# EAGLE design gps_tracker_A2235h (EAGLE 7.4.0)
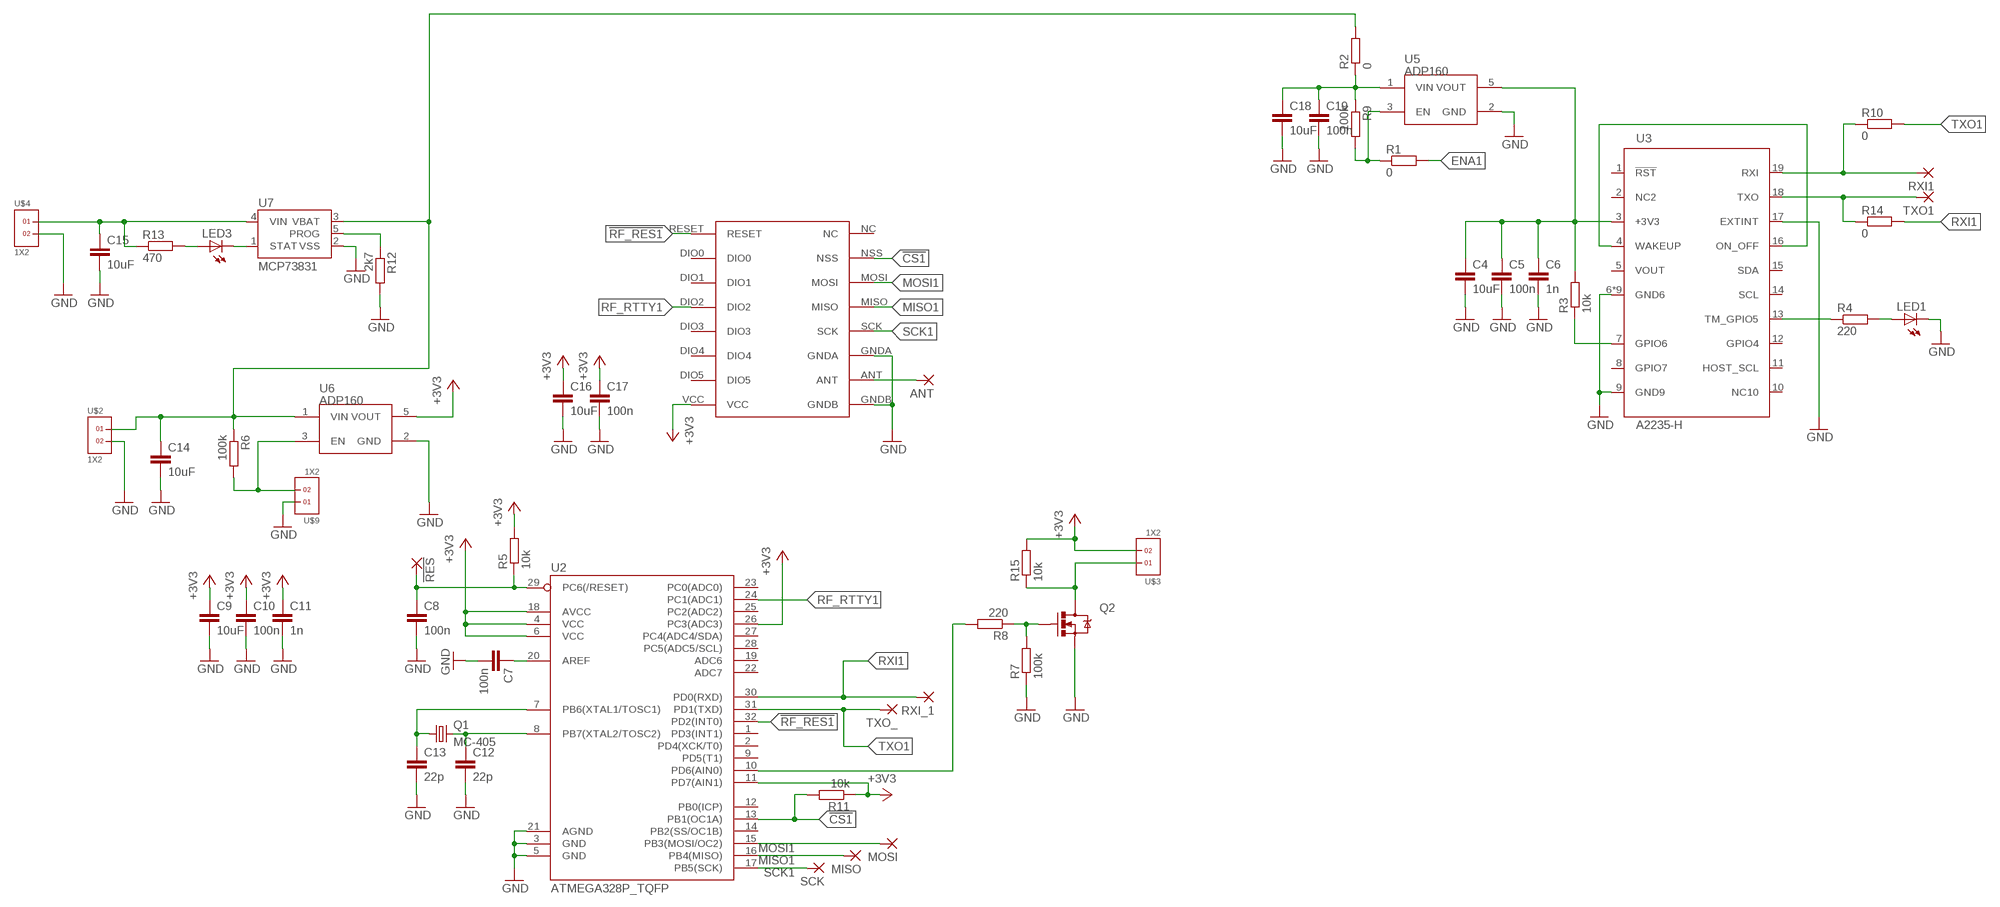
[diagram p0: schematic, sheet 1]

## Parts
!RES  SMD2  [SMD1,27-2,54]
ANT  SMD2  [SMD1,27-2,54]
C4  10uF  C-EUC0603  [C0603]
C5  100n  C-EUC0603  [C0603]
C6  1n  C-EUC0603  [C0603]
C7  100n  C-EUC0603  [C0603]
C8  100n  C-EUC0603  [C0603]
C9  10uF  C-EUC0603  [C0603]
C10  100n  C-EUC0603  [C0603]
C11  1n  C-EUC0603  [C0603]
C12  22p  C-EUC0603  [C0603]
C13  22p  C-EUC0603  [C0603]
C14  10uF  C-EUC0603  [C0603]
C15  10uF  C-EUC0603  [C0603]
C16  10uF  C-EUC0603  [C0603]
C17  100n  C-EUC0603  [C0603]
C18  10uF  C-EUC0603  [C0603]
C19  100n  C-EUC0603  [C0603]
LED1  LEDCHIPLED_0603  [CHIPLED_0603]
LED3  LEDCHIPLED_0603  [CHIPLED_0603]
MISO  SMD2  [SMD1,27-2,54]
MOSI  SMD2  [SMD1,27-2,54]
Q1  MC-405  [MC-405]
Q2  MOSFET-NCHANNELAO3404A  [SOT23-3]
R1  0  R-EU_R0603  [R0603]
R2  0  R-EU_R0603  [R0603]
R3  10k  R-EU_R0603  [R0603]
R4  220  R-EU_R0603  [R0603]
R5  10k  R-EU_R0603  [R0603]
R6  100k  R-EU_R0603  [R0603]
R7  100k  R-EU_R0603  [R0603]
R8  220  R-EU_R0603  [R0603]
R9  100k  R-EU_R0603  [R0603]
R10  0  R-EU_R0603  [R0603]
R11  10k  R-EU_R0603  [R0603]
R12  2k7  R-EU_R0603  [R0603]
R13  470  R-EU_R0603  [R0603]
R14  0  R-EU_R0603  [R0603]
R15  10k  R-EU_R0603  [R0603]
RXI1  SMD2  [SMD1,27-2,54]
RXI_1  SMD2  [SMD1,27-2,54]
SCK  SMD2  [SMD1,27-2,54]
TXO1  SMD2  [SMD1,27-2,54]
TXO_  SMD2  [SMD1,27-2,54]
U2  ATMEGA328P_TQFP  [TQFP32-08]
U3  A2235-H  [A2235-H]
U5  ADP160  [SOT23-5]
U6  ADP160  [SOT23-5]
U7  MCP73831  [SOT23-5]
U$2  1X2  [1X2]
U$3  1X2  [1X2]
U$4  1X2  [1X2]
U$5  RFM69HW  [RFM]
U$9  1X2  [1X2]

## Nets
!CS1: R11.2 U2.13(PB1(OC1A)) U$5.NSS
!RF_RES1: U2.32(PD2(INT0)) U$5.RESET
+3V3_1: C9.1 C10.1 C11.1 C16.1 C17.1 R5.2 R11.1 R15.2 U2.4(VCC) U2.6(VCC) U2.11(PD7(AIN1)) U2.18(AVCC) U2.26(PC3(ADC3)) U6.5(VOUT) U$3.2 U$5.VCC ; supply symbol labelled +3V3
+BAT1: C14.1 R2.2 R6.1 U6.1(VIN) U7.3(VBAT) U$2.1
ENA1: R1.2 R6.2 U6.3(EN) U$9.2
GND1: C4.2 C5.2 C6.2 C7.2 C8.2 C9.2 C10.2 C11.2 C12.2 C13.2 C14.2 C15.2 C16.2 C17.2 C18.2 C19.2 LED1.C Q2.2(S) R7.1 R12.2 U2.3(GND) U2.5(GND) U2.21(AGND) U3.6(GND6) U3.9(GND9) U3.17(EXTINT) U3.101(GND6) U3.102(GND6) U3.103(GND6) U3.104(GND6) U3.105(GND6) U3.106(GND6) U3.107(GND6) U3.108(GND6) U5.2(GND) U6.2(GND) U7.2(VSS) U$2.2 U$4.2 U$5.GNDA U$5.GNDB U$9.1 ; supply symbol labelled GND
MISO1: MISO.1(P) U2.16(PB4(MISO)) U$5.MISO
MOSI1: MOSI.1(P) U2.15(PB3(MOSI/OC2)) U$5.MOSI
N$2: R1.1 R9.2 U5.3(EN)
N$3: C18.1 C19.1 R2.1 R9.1 U5.1(VIN)
N$6: R3.1 U3.7(GPIO6)
N$7: LED1.A R4.2
N$8: R4.1 U3.13(TM_GPIO5)
N$9: U3.4(WAKEUP) U3.16(ON_OFF)
N$11: R12.1 U7.5(PROG)
N$12: C7.1 U2.20(AREF)
N$13: !RES.1(P) C8.1 R5.1 U2.29(PC6(/RESET))
N$14: ANT.1(P) U$5.ANT
N$15: C12.1 Q1.2 U2.8(PB7(XTAL2/TOSC2))
N$16: C13.1 Q1.1 U2.7(PB6(XTAL1/TOSC1))
N$18: LED3.C U7.1(STAT)
N$19: Q2.1(G) R7.2 R8.1
N$20: R8.2 U2.10(PD6(AIN0))
N$21: Q2.3(D) R15.1 U$3.1
N$22: LED3.A R13.2
N$24: C15.1 R13.1 U7.4(VIN) U$4.1
N$27: C4.1 C5.1 C6.1 R3.2 U3.3(+3V3) U5.5(VOUT)
RF_RTTY1: U2.24(PC1(ADC1)) U$5.DIO2
RXI1: R14.2 RXI_1.1(P) U2.30(PD0(RXD))
RXI_G1: R10.1 RXI1.1(P) U3.19(RXI)
SCK1: SCK.1(P) U2.17(PB5(SCK)) U$5.SCK
TXO1: R10.2 TXO_.1(P) U2.31(PD1(TXD))
TXO_G1: R14.1 TXO1.1(P) U3.18(TXO)
Unconnected: U2.1(PD3(INT1)) U2.2(PD4(XCK/T0)) U2.9(PD5(T1)) U2.12(PB0(ICP)) U2.14(PB2(SS/OC1B)) U2.19(ADC6) U2.22(ADC7) U2.23(PC0(ADC0)) U2.25(PC2(ADC2)) U2.27(PC4(ADC4/SDA)) U2.28(PC5(ADC5/SCL)) U3.1(!RST) U3.2(NC2) U3.8(GPIO7) U3.10(NC10) U3.11(HOST_SCL) U3.12(GPIO4) U3.14(SCL) U3.15(SDA) U$5.DIO0 U$5.DIO1 U$5.DIO3 U$5.DIO4 U$5.DIO5 U$5.NC

## Power pins joined to a net without a drawn wire
VOUT: U3.5(VOUT)

## Library data of the parts
!RES ANT MISO MOSI RXI1 RXI_1 SCK TXO1 TXO_ = wirepad:SMD2: SMD PAD
C4-C19 = rcl:C-EU: CAPACITOR, European symbol
LED1 LED3 = led:LED: LED OSRAM: - CHIPLED LG R971, LG N971, LY N971, LG Q971, LY Q971, LO R971, LY R971 LH N974, LH R974 LS Q976, LO Q976, LY Q976 LO Q996 - Hyper CHIPLED LW Q18S LB Q993, LB Q99A, LB R99A - SideLED LS A670, LO A670, LY A670, LG A670, LP A670 LB A673, LV A673, LT A673, LW A673 LH A674 LY A675 LS A676, LA A676, LO A676, LY A676, LW A676 LS A679, LY A679, LG A679 - Hyper Micro SIDELED® LS Y876, LA Y876, LO Y876, LY Y876 LT Y87S - SmartLED LW L88C, LW L88S LB L89C, LB L89S, LG L890 LS L89K, LO L89K, LY L89K LS L896, LA L896, LO L896, LY L896 - TOPLED LS T670, LO T670, LY T670, LG T670, LP T670 LSG T670, LSP T670, LSY T670, LOP T670, LYG T670 LG T671, LOG T671, LSG T671 LB T673, LV T673, LT T673, LW T673 LH T674 LS T676, LA T676, LO T676, LY T676, LB T676, LH T676, LSB T676, LW T676 LB T67C, LV T67C, LT T67C, LS T67K, LO T67K, LY T67K, LW E67C LS E67B, LA E67B, LO E67B, LY E67B, LB E67C, LV E67C, LT E67C LW T67C LS T679, LY T679, LG T679 LS T770, LO T770, LY T770, LG T770, LP T770 LB T773, LV T773, LT T773, LW T773 LH T774 LS E675, LA E675, LY E675, LS T675 LS T776, LA T776, LO T776, LY T776, LB T776 LHGB T686 LT T68C, LB T68C - Hyper Mini TOPLED® LB M676 - Mini TOPLED Santana® LG M470 LS M47K, LO M47K, LY M47K Source: http://www.osram.convergy.de LUXEON: - LUMILED® LXK2-PW12-R00, LXK2-PW12-S00, LXK2-PW14-U00, LXK2-PW14-V00 LXK2-PM12-R00, LXK2-PM12-S00, LXK2-PM14-U00 LXK2-PE12-Q00, LXK2-PE12-R00, LXK2-PE12-S00, LXK2-PE14-T00, LXK2-PE14-U00 LXK2-PB12-K00, LXK2-PB12-L00, LXK2-PB12-M00, LXK2-PB14-N00, LXK2-PB14-P00, LXK2-PB14-Q00 LXK2-PR12-L00, LXK2-PR12-M00, LXK2-PR14-Q00, LXK2-PR14-R00 LXK2-PD12-Q00, LXK2-PD12-R00, LXK2-PD12-S00 LXK2-PH12-R00, LXK2-PH12-S00 LXK2-PL12-P00, LXK2-PL12-Q00, LXK2-PL12-R00 Source: www.luxeon.com KINGBRIGHT: KA-3528ASYC Source: www.kingbright.com
Q1 = gps_tracker:MC-405: kHz RANGE CRYSTAL UNIT SMD Source: MC-306_405_406_E07X.PDF Homepage <http://www.epsontoyocom.co.jp>; FARNELL: 2508596; OC_FARNELL: unknown; OC_NEWARK: unknown
Q2 = SparkFun-DiscreteSemi:MOSFET-NCHANNEL: Common NMOSFET Parts MFG P/N Store ID Prod ID FDD8780 TRANS-09984 SI7820DN TRANS-11055 FDS6630A IC-08089 2N7002PW TRANS-11151 FQP30N06L COM-10213 TRANS-10060 BSS123LT1G TRANS-08345 BSS138 TRANS-00830 BS170 2N7000; PROD_ID: TRAN-12988
R1-R15 = rcl:R-EU_: RESISTOR, European symbol
U2 = SparkFun-DigitalIC:ATMEGA328P_TQFP; PROD_ID: IC-09069
U3 = gps_tracker:A2235-H
U5 U6 = SparkFun-PowerIC:ADP160: Nanopower LDO Iq less than 1uA for low Iload; FARNELL: 2510377; PROD_ID: VREG-11306
U7 = SparkFun-PowerIC:MCP73831: Miniature single cell, fully integrated Li-Ion, Li-polymer charge management controller http://ww1.microchip.com/downloads/en/DeviceDoc/20001984g.pdf IC-09995; FARNELL: 1834892; PROD_ID: IC-09995
U$2-U$4 U$9 = headers(2mm)(samtec):1X2
U$5 = gps_tracker:RFM69HW

## Board
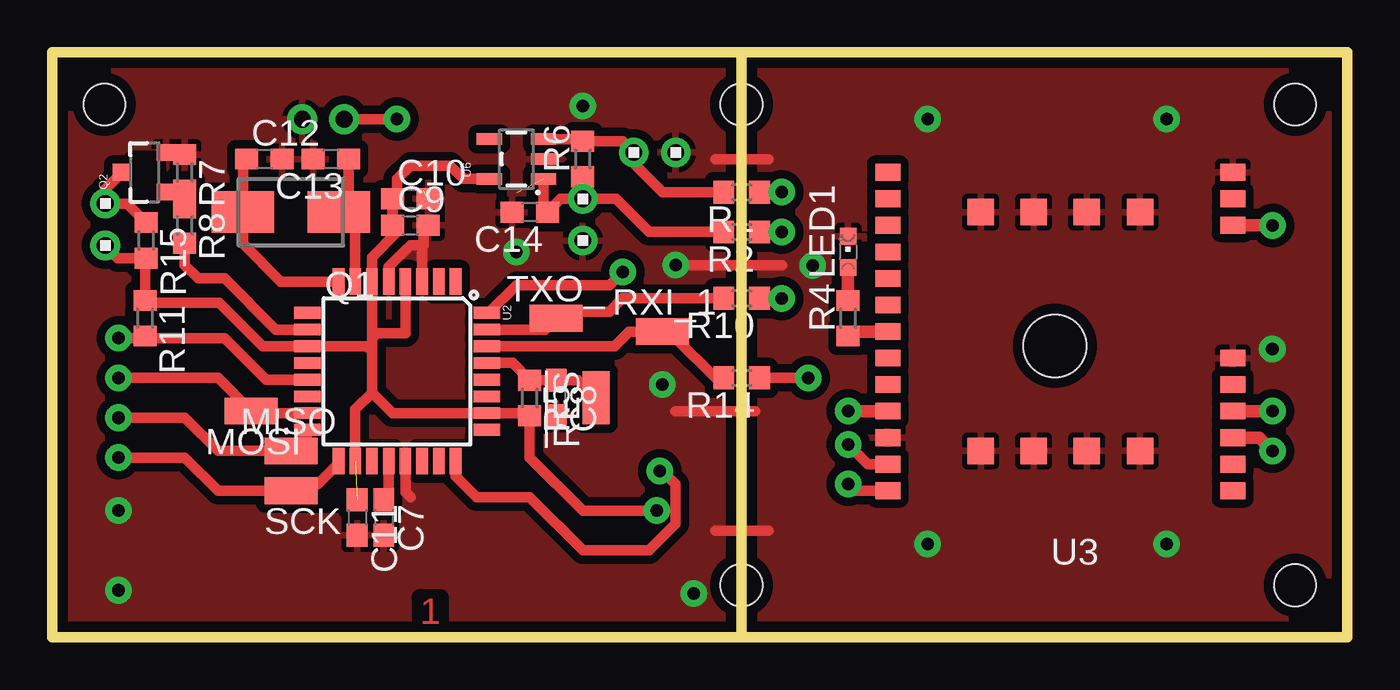
[diagram p1: board, top side]
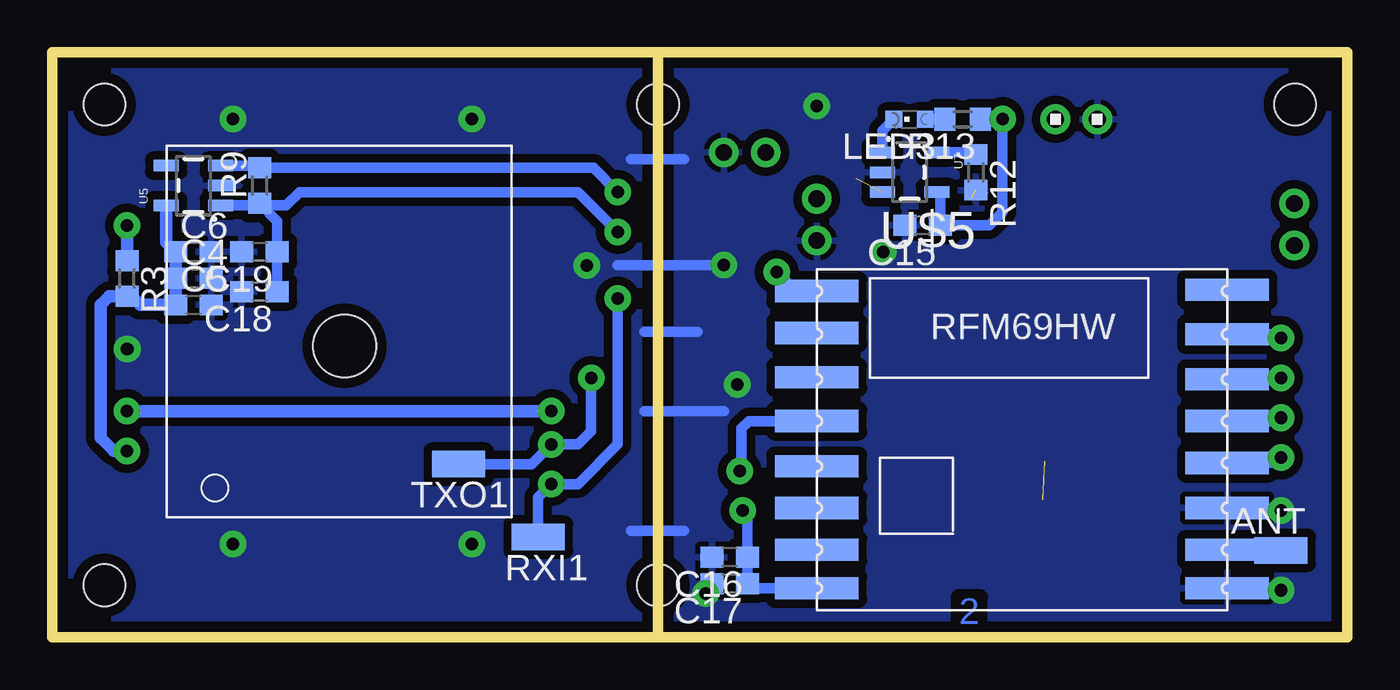
[diagram p2: board, bottom side, seen from below]

Size 62 x 28 mm. Coordinates in mm from the lower left corner, seen from the top.
Outline: 33,28 0,28 0,0 33,0
Outline: 33,28 33,0
Outline: 33,28 62,28 62,0 33,0
Copper layers (1*16): Top 0.035mm / dielectric 1.5mm / Bottom 0.035mm
Design rules "default *": minimum track width 10mil, minimum drill 24mil, track to track 8mil, track to pad 8mil, pad to pad 8mil, via to via 8mil, smd to smd 8mil, copper to edge 20mil, drill to drill 8mil, minimum pad ring 10mil, minimum via ring 8mil, stop-mask expansion 4mil, vias tented up to drill 0mil, thermal gap 10mil
Holes 2 mm at 2.5,25.5 59.5,25.5 33,2.5 33,25.5 59.5,2.5
Holes 3 mm at 2.22,-5.08 59.37,-4.13 2.22,33.97 59.05,33.34
tRestrict: area 3.8,22.3 to 5.1,22.9; area 10.2,21 to 12.7,21.6; area 12.7,24.2 to 13.3,24.8; area 12.7,6.4 to 14,7

### Footprints (pad centres in the part's own frame; a part is rotated, then mirrored left to right if it is on the bottom)
SMD1,27-2,54 = smd 1.27 x 2.54: 1 0,0
C0603 = smd 1.1 x 1: 1 -0.85,0; 2 0.85,0
CHIPLED_0603 = smd 0.8 x 0.8: A 0,-0.75; C 0,0.75
MC-405 = smd 3 x 2: 1 -2.3,0; 2 2.3,0
SOT23-3 = smd 0.8 x 0.9: 1 -0.95,-1; 2 0.95,-1; 3 0,1.1
R0603 = smd 1 x 1.1: 1 -0.85,0; 2 0.85,0
TQFP32-08 = smd 1.27 x 0.559: 1 -4.293,2.8; 2 -4.293,2; 3 -4.293,1.2; 4 -4.293,0.4; 5 -4.293,-0.4; 6 -4.293,-1.2; 7 -4.293,-2; 8 -4.293,-2.8; 17 4.293,-2.8; 18 4.293,-2; 19 4.293,-1.2; 20 4.293,-0.4; 21 4.293,0.4; 22 4.293,1.2; 23 4.293,2; 24 4.293,2.8 | smd 0.559 x 1.27: 9 -2.8,-4.293; 10 -2,-4.293; 11 -1.2,-4.293; 12 -0.4,-4.293; 13 0.4,-4.293; 14 1.2,-4.293; 15 2,-4.293; 16 2.8,-4.293; 25 2.8,4.293; 26 2,4.293; 27 1.2,4.293; 28 0.4,4.293; 29 -0.4,4.293; 30 -1.2,4.293; 31 -2,4.293; 32 -2.8,4.293
A2235-H = smd 1.2 x 0.8: 1 -8.255,7.62; 2 -8.255,6.35; 3 -8.255,5.08; 4 -8.255,3.81; 5 -8.255,2.54; 6 -8.255,1.27; 7 -8.255,-5.08; 8 -8.255,-6.35; 9 -8.255,-7.62; 10 8.255,-3.81; 11 8.255,-2.54; 12 8.255,-1.27; 13 8.255,0; 14 8.255,1.27; 15 8.255,2.54; 16 8.255,3.81; 17 8.255,5.08; 18 8.255,6.35; 19 8.255,7.62; 201 8.255,-5.08; 202 8.255,-6.35; 203 8.255,-7.62 | smd 1.27 x 1.27: 101 1.27,-5.715; 102 -3.81,-5.715; 103 -3.81,5.715; 104 -1.27,-5.715; 105 -1.27,5.715; 106 3.81,-5.715; 107 3.81,5.715; 108 1.27,5.715 | hole 3: 0.255,0.69
SOT23-5 = smd 0.55 x 1.2: 1 -0.95,-1.3; 2 0,-1.3; 3 0.95,-1.3; 4 0.95,1.3; 5 -0.95,1.3
1X2 = drill 0.8 pad 1.422: 1 0,0; 2 2,0
RFM = smd 4 x 1.067: ANT 9.491,-4.731; DIO0 -10.16,5.65; DIO1 -10.16,3.522; DIO2 -10.16,1.427; DIO3 -10.16,-0.731; DIO4 -10.16,-2.731; DIO5 -10.16,-4.731; GNDA 9.491,-2.731; GNDB 9.491,-6.572; MISO 9.491,1.427; MOSI 9.491,3.428; NC 9.491,7.714; NSS 9.491,5.586; RESET -10.16,7.65; SCK 9.491,-0.573; VCC -10.16,-6.572

### Placement (x,y rotation side)
!RES  26.04,11.46 0 top
ANT  3.17,4.16 270 bottom
C4  55.24,17.18 0 bottom
C5  55.24,15.9 0 bottom
C6  55.24,18.45 0 bottom
C7  15.88,5.75 270 top
C8  24.13,11.46 270 top
C9  17.14,19.71 0 top
C10  17.14,20.98 0 top
C11  14.61,5.75 270 top
C12  10.16,22.89 0 top
C13  13.34,22.89 180 top
C14  22.86,20.35 180 top
C15  20.32,19.71 180 bottom
C16  29.57,3.84 180 bottom
C17  29.57,2.57 180 bottom
C18  52.07,16.54 180 bottom
C19  52.07,18.45 180 bottom
LED1  38.1,18.45 0 top
LED3  20.95,24.8 90 bottom
MISO  11.43,8.92 270 top
MOSI  9.53,10.82 90 top
Q1  11.43,20.35 180 top
Q2  4.45,22.25 90 top
R1  33,21.3 180 top
R2  33,19.4 180 top
R3  58.42,17.18 270 bottom
R4  38.1,15.27 90 top
R5  22.86,11.46 270 top
R6  25.4,22.89 90 top
R7  6.35,22.25 270 top
R8  6.35,19.71 270 top
R9  52.07,21.62 90 bottom
R10  33,16.22 180 top
R11  4.45,15.27 270 top
R12  17.78,22.25 270 bottom
R13  18.41,24.8 180 bottom
R14  33,12.41 180 top
R15  4.5,19 270 top
RXI1  38.74,4.79 90 bottom
RXI_1  29.21,14.63 270 top
SCK  11.43,7.01 90 top
TXO1  42.55,8.29 90 bottom
TXO_  24.13,15.27 270 top
U2  16.51,12.73 270 top
U3  48.26,14.63 180 top
U5  55.24,21.62 90 bottom
U6  22.23,22.89 90 top
U7  20.95,22.25 270 bottom
U$2  25.4,20.98 270 top
U$3  2.54,20.75 270 top
U$4  13.97,24.8 0 bottom
U$5  15.24,8.92 0 bottom
U$9  29.85,23.21 180 top

### Tracks (layer width: path | path; a pad name or v marks a point on that pad's centre or on a via)
!CS1  (via drill 0.6 pad 1.27)
  Top 0.5: U2.13 10.24,12.33 8.26,14.32 4.55,14.32 R11.2 4.34,14.32 v3.18,14.32
  Bottom 0.5: 2.99,14.51 v3.18,14.32 3.37,14.51 U$5.NSS
!RF_RES1  (via drill 0.6 pad 1.27)
  Top 0.5: v27.31,17.49 26.67,16.86 22.23,16.86 20.9,15.53 U2.32
  Bottom 0.5: U$5.RESET 26.38,16.57 v27.31,17.49
+3V3_1  (via drill 0.6 pad 1.27)  (1 unrouted)
  Top 0.5: v28.94,6.06 25.4,6.06 22.86,8.6 R5.2 22.74,10.73 U2.26 16.29,10.73 15.31,11.71 | 15.31,14.32 U2.6 15.31,18.2 16.51,19.4 16.51,19.5 C9.1 | 15.31,14.32 15.31,13.68 | 15.31,13.68 15.31,11.71 | 15.31,13.68 15.06,13.93 U2.11 10.07,13.93 8,16 4.57,16 R11.1 4.45,18.09 R15.2 3.15,18.15 U$3.2 | U2.18 14.51,10.91 15.31,11.71 | U2.4 16.91,14.55 15.55,14.55 15.31,14.32 | U6.5 19.68,21.94 19.05,22.57 17.15,22.57 16.51,21.94 16.51,21.2 C10.1 C9.1 | C9.1 16.19,19.71
  Bottom 0.5: v28.94,6.06 28.73,5.85 C16.1 C17.1 28.5,2.35 U$5.VCC
+BAT1  (1 unrouted)
  Top 0.5: U$2.1 R6.1 | U6.1 23.52,20.54 C14.1 24.34,20.98 U$2.1 | R2.2 28.58,19.4 26.99,20.98 U$2.1
ENA1
  Top 0.5: U6.3 25.3,23.84 R6.2 27.31,23.74 U$9.2 27.94,23.11 27.94,22.57 29.21,21.3 R1.2
GND1  (via drill 0.6 pad 1.27)  (1 unrouted)
  Top 0.5: U2.21 16.91,6.93 17.15,6.7 | Q2.2 6.25,23.2 R7.1 | U2.5 16.11,17.73 17.15,18.76 17.78,18.76 | 17.78,18.76 17.78,19.5 C9.2 | U2.3 17.71,18.69 17.78,18.76 | 34.29,5.11 31.75,5.11 | 34.93,17.81 v29.85,17.81 | 34.29,22.89 31.75,22.89 | 33.66,10.82 29.85,10.82
  Bottom 0.5: 34.29,5.11 31.75,5.11 | 34.93,17.81 v29.85,17.81 | 34.29,22.89 31.75,22.89 | 33.66,10.82 29.85,10.82 | 33.66,14.63 31.12,14.63
  other vias: 3.18,6.06 3.18,2.25 22.23,18.45 29.21,12.1 53.34,24.8 41.91,24.8 41.91,4.47 53.34,4.47 25.4,25.43 30.71,2.1 58.41,13.79 36.41,17.8
  pour Bottom (isolate 0.406): 62.23,-1.24 62.23,29.24 -1.27,29.24 -1.27,-1.24
  pour Top (isolate 0.406): 62.23,-1.24 62.23,29.24 -1.27,29.24 -1.27,-1.24
MISO1  (via drill 0.6 pad 1.27)
  Top 0.5: U2.16 12.22,9.71 MISO.1 7.94,8.92 6.35,10.51 v3.18,10.51
  Bottom 0.5: U$5.MISO 3.34,10.35 v3.18,10.51
MOSI1  (via drill 0.6 pad 1.27)
  Top 0.5: U2.15 9.62,10.73 MOSI.1 7.94,12.41 v3.18,12.41
  Bottom 0.5: U$5.MOSI 3.24,12.35 v3.18,12.41
N$2  (via drill 0.6 pad 1.27)
  Top 0.5: v34.93,21.3 R1.1
  Bottom 0.5: U5.3 52.17,22.57 R9.2 36.09,22.47 v34.93,21.3
N$3  (via drill 0.6 pad 1.27)
  Top 0.5: R2.1 v34.93,19.4
  Bottom 0.5: C18.1 C19.1 51.22,19.92 R9.1 | U5.1 52.17,20.67 R9.1 | v34.93,19.4 36.83,21.3 50.17,21.3 50.8,20.67 51.97,20.67 R9.1
N$6  (via drill 0.6 pad 1.27)
  Top 0.61: U3.7 v58.42,19.71
  Bottom 0.61: v58.42,19.71 R3.1
N$7
  Top 0.61: LED1.A R4.2
N$8
  Top 0.61: U3.13 38.31,14.63 R4.1
N$9  (via drill 0.6 pad 1.27)
  Top 0.61: U3.4 v58.42,10.82 | v38.1,10.82 U3.16
  Bottom 0.61: v58.42,10.82 v38.1,10.82
N$11
  Bottom 0.5: U7.5 17.88,23.2 R12.1
N$12
  Top 0.5: U2.20 16.11,6.83 C7.1
N$13
  Top 0.5: U2.29 22.04,13.13 R5.1 C8.1 25.18,12.31 !RES.1
N$14
  Bottom 0.5: ANT.1 5.72,4.16 U$5.ANT
N$15
  Top 0.5: U2.8 10.95,17.02 9.13,18.84 Q1.2 9.13,22.71 C12.1
N$16
  Top 0.5: U2.7 14.51,19.57 Q1.1 14.19,20.8 C13.1
N$18
  Bottom 0.5: U7.1 22.25,24.25 LED3.C
N$19
  Top 0.5: Q2.1 6.25,21.3 R7.2 R8.1
N$20
  Top 0.5: U2.10 10.7,14.73 8.26,17.18 6.99,17.18 6.35,17.81 R8.2
N$21
  Top 0.5: Q2.3 2.54,21.45 U$3.1 3.6,20.75 R15.1
N$22
  Bottom 0.5: LED3.A R13.2
N$24  (via drill 0.6 pad 1.27)
  Top 0.5: U$4.1 v16.51,24.8
  Bottom 0.5: U7.4 19.47,21.12 C15.1 17.14,19.71 16.51,20.35 v16.51,24.8 R13.1
N$27  (via drill 0.6 pad 1.27)
  Top 0.61: U3.3 57.78,9.55 v58.42,8.92
  Bottom 0.61: U5.5 56.55,18.89 C6.1 C4.1 C5.1 57.78,15.9 58.2,16.32 R3.2 59.27,16.32 59.69,15.9 59.69,9.55 59.05,8.92 v58.42,8.92
RF_RTTY1  (via drill 0.6 pad 1.27)
  Top 0.5: v29.08,7.97 29.21,7.97 29.85,7.33 29.85,5.43 28.58,4.16 25.4,4.16 22.86,6.7 20.32,6.7 19.31,7.71 U2.24
  Bottom 0.5: U$5.DIO2 28.65,10.35 29,10 29,8.04 v29.08,7.97
RXI1
  Top 0.5: U2.30 26.92,13.93 27.62,14.63 RXI_1.1 29.53,14.32 29.85,14.32 31.75,12.41 R14.2
RXI_G1  (via drill 0.6 pad 1.27)
  Top 0.5: R10.1 v34.93,16.22 | U3.19 38.42,7.01 v38.1,7.33
  Bottom 0.5: v34.93,16.22 34.93,9.24 36.83,7.33 v38.1,7.33 38.74,6.7 RXI1.1
SCK1  (via drill 0.6 pad 1.27)
  Top 0.5: U2.17 13.71,8.34 12.7,7.33 11.75,7.33 SCK.1 7.94,7.01 6.35,8.6 v3.18,8.6
  Bottom 0.5: U$5.SCK 3.43,8.35 v3.18,8.6
TXO1
  Top 0.5: U2.31 23.59,14.73 TXO_.1 24.45,15.59 26.67,15.59 27.31,16.22 R10.2
TXO_G1  (via drill 0.6 pad 1.27)
  Top 0.5: U3.18 39.05,8.29 v38.1,9.24 | R14.1 v36.2,12.41
  Bottom 0.5: v36.2,12.41 36.2,9.87 36.83,9.24 v38.1,9.24 39.05,8.29 TXO1.1

### Text on the board
Top: 1
Bottom: 2